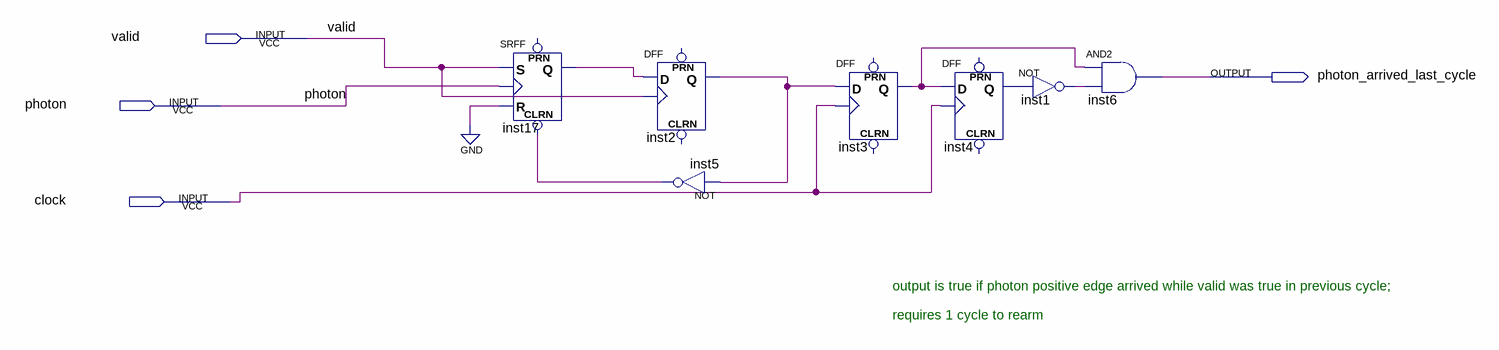
[diagram p0: schematic sheet]
// Quartus schematic edge_coincidence_simple.bdf as structural Verilog: 7 symbols, 4 pins
module edge_coincidence_simple (
  input  valid,
  input  photon,
  input  clock,
  output photon_arrived_last_cycle
);

  wire inst1_out, inst2_q, inst3_q, inst4_q, inst5_out, inst17_q;

  SRFF inst17 (.CLRN(inst5_out), .S(valid), .R(1'b0), .CLK(photon), .Q(inst17_q));  // open: PRN
  DFF inst2 (.CLK(valid), .D(inst17_q), .Q(inst2_q));  // open: CLRN, PRN
  not inst5 (inst5_out, inst2_q);
  DFF inst3 (.CLK(clock), .D(inst2_q), .Q(inst3_q));  // open: CLRN, PRN
  DFF inst4 (.CLK(clock), .D(inst3_q), .Q(inst4_q));  // open: CLRN, PRN
  not inst1 (inst1_out, inst4_q);
  and inst6 (photon_arrived_last_cycle, inst3_q, inst1_out);

  // Notes on the sheet:
  //   output is true if photon positive edge arrived while valid was true in previous cycle;
  //   requires 1 cycle to rearm
endmodule
